# EAGLE design esquematico drone (EAGLE 9.6.2)
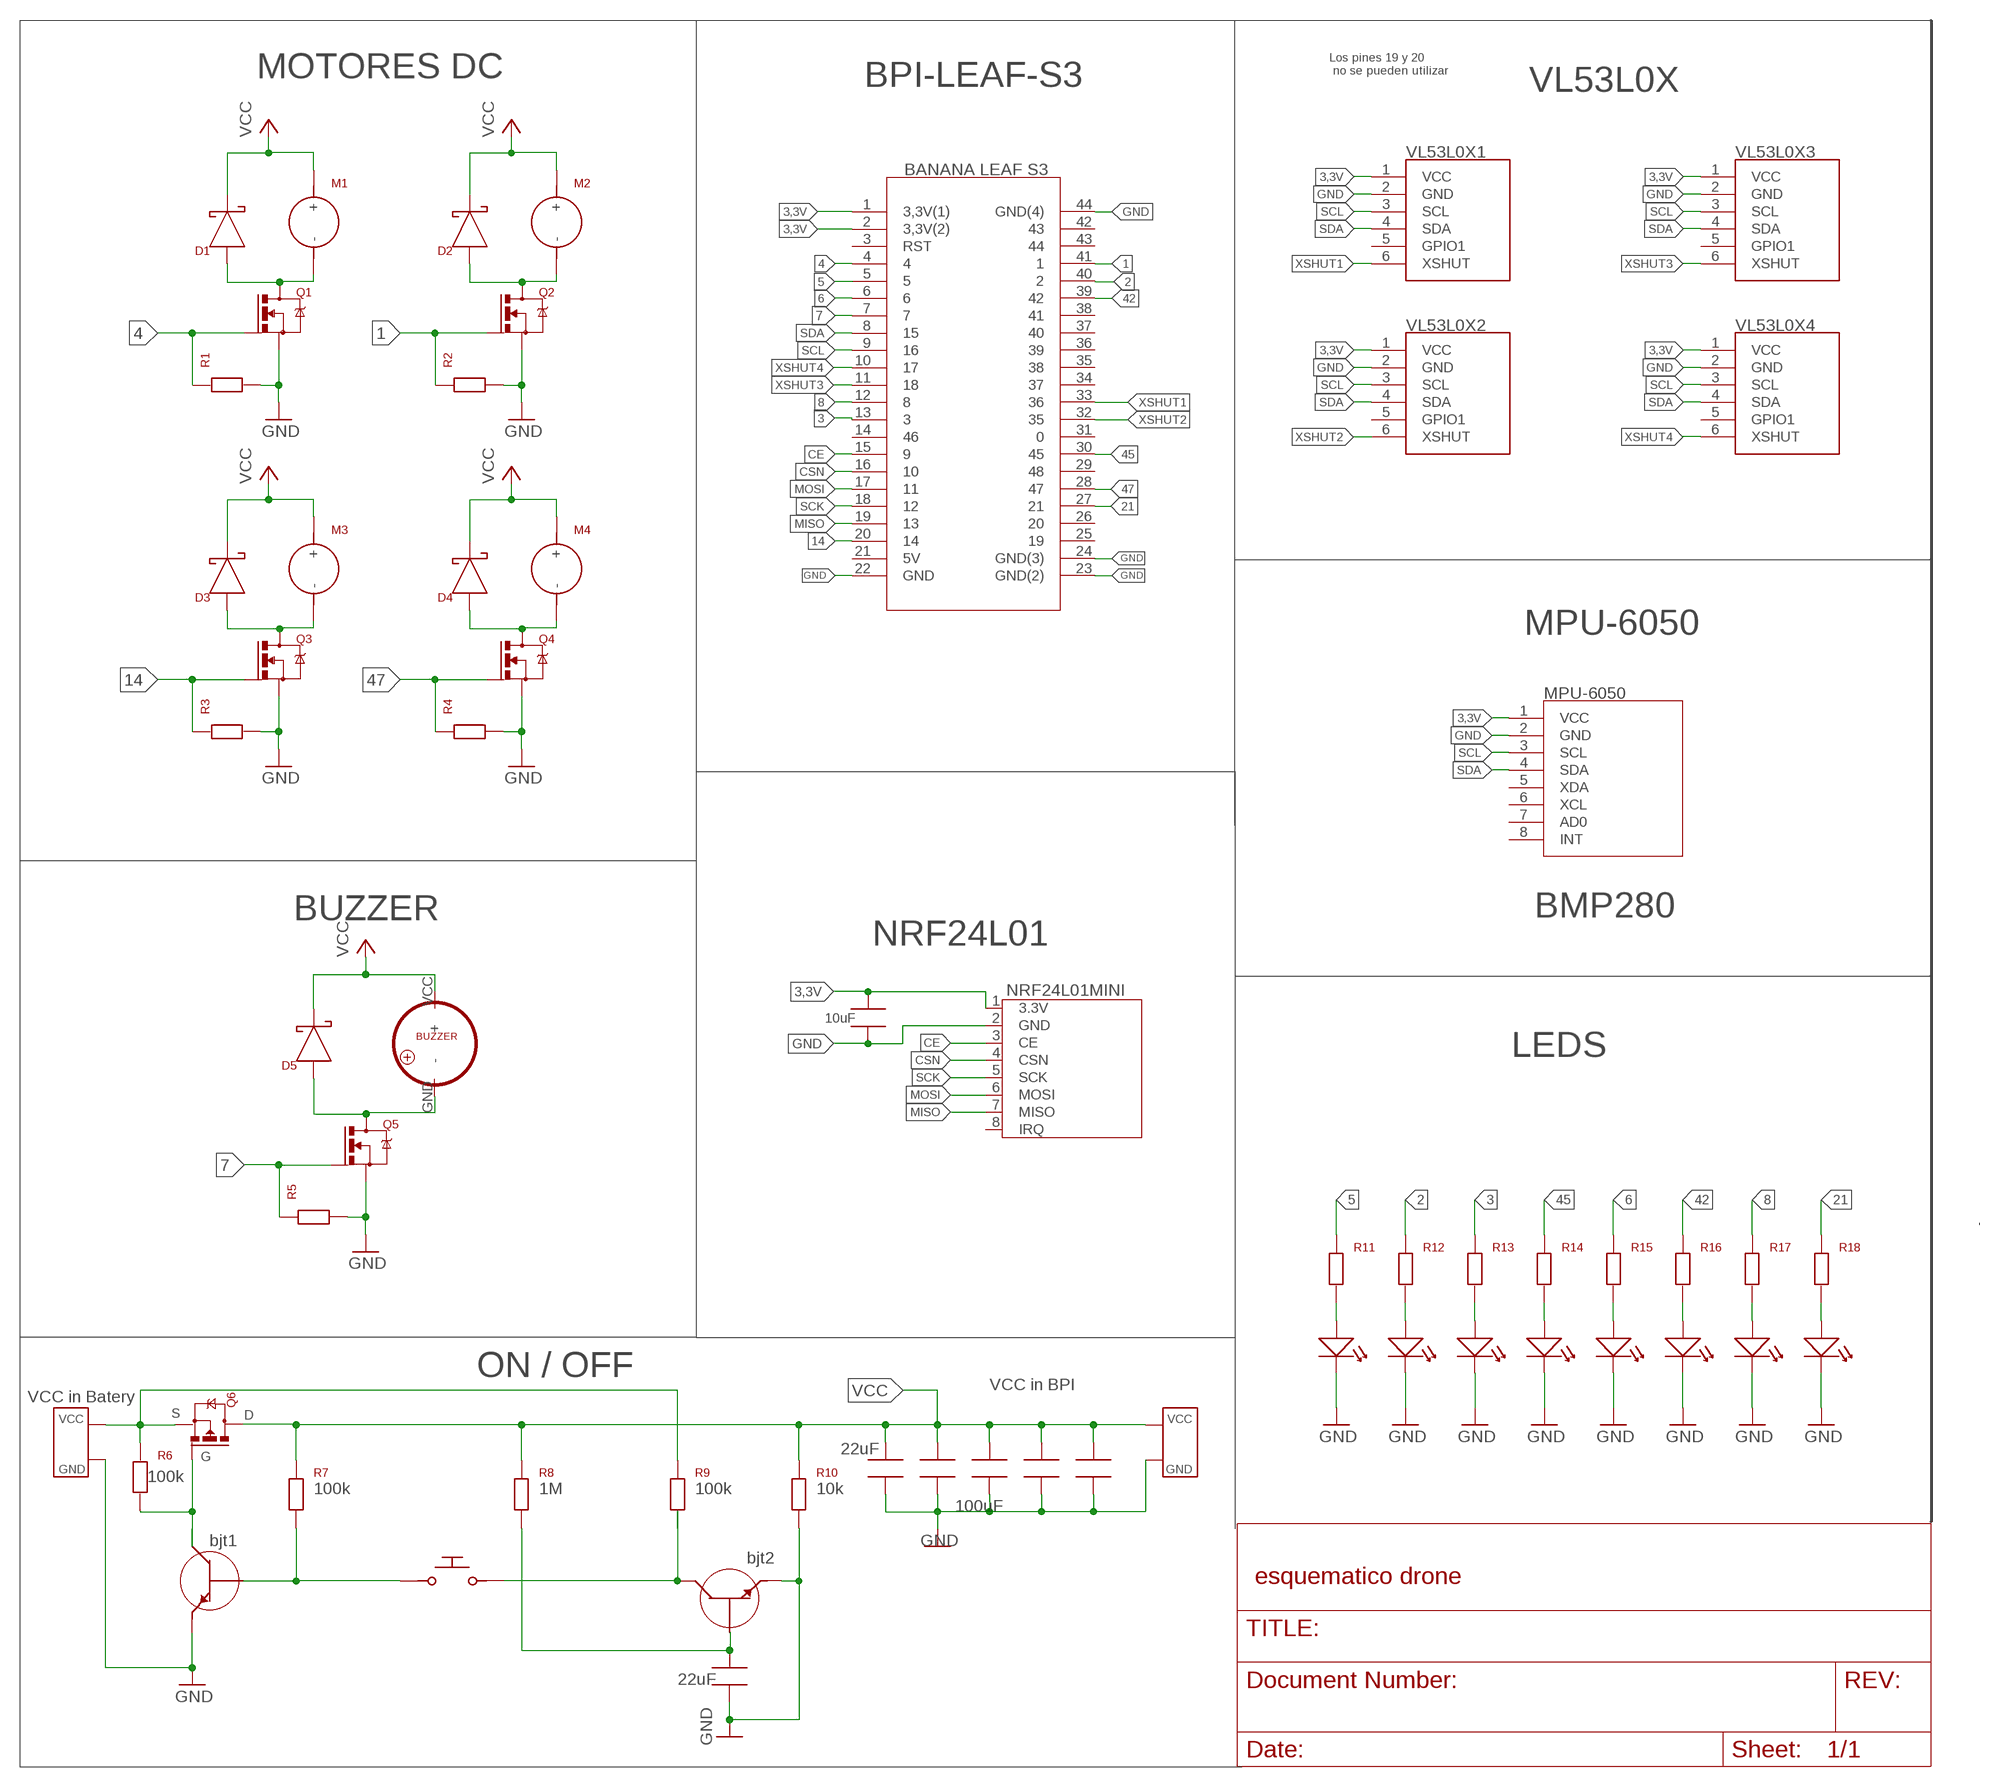
[diagram p0: schematic, sheet 1]

## Parts
BANANALEAFS1  BANANALEAFS3  [BANANALEAF]
BAT1  BATBAT  [BAT]
BAT2  BATBAT  [BAT]
BJT1  MMBT3904  [MMBT3904]
BJT2  MMBT3904  [MMBT3904]
C1  100uF  CAPACITOR-100UFCAPACITOR  [CAPACITOR-100UF]
C2  CAPACITOR-22UF  [CAPACITOR-22UF]
C3  100uF  CAPACITOR-100UFCAPACITOR  [CAPACITOR-100UF]
C4  CAPACITOR-100UFCAPACITOR  [CAPACITOR-100UF]
C5  CAPACITOR-100UFCAPACITOR  [CAPACITOR-100UF]
C6  CAPACITOR-100UFCAPACITOR  [CAPACITOR-100UF]
C7  CAPACITOR-22UF  [CAPACITOR-22UF]
D1  SS12  [SS12]
D2  SS12  [SS12]
D3  SS12  [SS12]
D4  SS12  [SS12]
D5  SS12  [SS12]
LED1  LEDS  [LEDS]
LED2  LEDS  [LEDS]
LED3  LEDS  [LEDS]
LED4  LEDS  [LEDS]
LED5  LEDS  [LEDS]
LED6  LEDS  [LEDS]
LED7  LEDS  [LEDS]
LED8  LEDS  [LEDS]
M1  MOTORM  [MOTOR]
M2  MOTORM  [MOTOR]
M3  MOTORM  [MOTOR]
M4  MOTORM  [MOTOR]
MPU1  MPU6050MPU6050  [MPU6050]
NRF24L1  NRF24L01MINI  [NRF24L01MINI]
P1  PULSADOR  [PULSADOR]
Q1  SI2302  [SI2302]
Q2  SI2302  [SI2302]
Q3  SI2302  [SI2302]
Q4  SI2302  [SI2302]
Q5  SI2302  [SI2302]
Q6  SI2301SI2301  [SI2301]
R1  RESISTOR-0805  [RESISTOR-0805]
R2  RESISTOR-0805  [RESISTOR-0805]
R3  RESISTOR-0805  [RESISTOR-0805]
R4  RESISTOR-0805  [RESISTOR-0805]
R5  RESISTOR-0805  [RESISTOR-0805]
R6  RESISTOR-0805  [RESISTOR-0805]
R7  RESISTOR-0805  [RESISTOR-0805]
R8  RESISTOR-0805  [RESISTOR-0805]
R9  RESISTOR-0805  [RESISTOR-0805]
R10  RESISTOR-0805  [RESISTOR-0805]
R11  RESISTOR-0805  [RESISTOR-0805]
R12  RESISTOR-0805  [RESISTOR-0805]
R13  RESISTOR-0805  [RESISTOR-0805]
R14  RESISTOR-0805  [RESISTOR-0805]
R15  RESISTOR-0805  [RESISTOR-0805]
R16  RESISTOR-0805  [RESISTOR-0805]
R17  RESISTOR-0805  [RESISTOR-0805]
R18  RESISTOR-0805  [RESISTOR-0805]
U$2  BUZZER  [BUZZER]
VL53L0X1  VL53L0X  [VL53L0X]
VL53L0X2  VL53L0X  [VL53L0X]
VL53L0X3  VL53L0X  [VL53L0X]
VL53L0X4  VL53L0X  [VL53L0X]

## Nets
1: BANANALEAFS1.41 Q2.G R2.S1
2: BANANALEAFS1.40 R12.S1
3: BANANALEAFS1.13 R13.S1
3,3V: BANANALEAFS1.1(3,3V(1)) BANANALEAFS1.2(3,3V(2)) C7.S1(C1) MPU1.1(VCC) NRF24L1.1(3.3V) VL53L0X1.1(VCC) VL53L0X2.1(VCC) VL53L0X3.1(VCC) VL53L0X4.1(VCC)
4: BANANALEAFS1.4 Q1.G R1.S1
5: BANANALEAFS1.5 R11.S1
6: BANANALEAFS1.6 R15.S1
7: BANANALEAFS1.7 Q5.G R5.S1
8: BANANALEAFS1.12 R17.S1
14: BANANALEAFS1.20 Q3.G R3.S1
21: BANANALEAFS1.27 R18.S1
42: BANANALEAFS1.39 R16.S1
45: BANANALEAFS1.30 R14.S1
47: BANANALEAFS1.28 Q4.G R4.S1
CE: BANANALEAFS1.15 NRF24L1.3(CE)
CSN: BANANALEAFS1.16 NRF24L1.4(CSN)
GND: BANANALEAFS1.22(GND) BANANALEAFS1.23(GND(2)) BANANALEAFS1.24(GND(3)) BANANALEAFS1.44(GND(4)) BAT1.GND BAT2.GND BJT1.E BJT2.E C1.C2 C2.S2(C2) C3.C2 C4.C2 C5.C2 C6.C2 C7.S2(C2) LED1.C LED2.C LED3.C LED4.C LED5.C LED6.C LED7.C LED8.C MPU1.2(GND) NRF24L1.2(GND) Q1.S Q2.S Q3.S Q4.S Q5.S R1.S2 R2.S2 R3.S2 R4.S2 R5.S2 R10.S2 VL53L0X1.2(GND) VL53L0X2.2(GND) VL53L0X3.2(GND) VL53L0X4.2(GND)
MISO: BANANALEAFS1.19 NRF24L1.7(MISO)
MOSI: BANANALEAFS1.17 NRF24L1.6(MOSI)
N$1: D1.A M1.- Q1.D
N$2: LED1.A R11.S2
N$3: D2.A M2.- Q2.D
N$4: D3.A M3.- Q3.D
N$5: BAT2.VCC Q6.S R6.S1 R9.S1
N$6: BJT1.C Q6.G R6.S2
N$7: D5.A Q5.D U$2.GND(-)
N$8: LED2.A R12.S2
N$9: BJT1.B P1.P1 R7.S2
N$10: BJT2.C P1.P2 R9.S2
N$11: BJT2.B C2.S1(C1) R8.S2
N$12: LED3.A R13.S2
N$13: LED4.A R14.S2
N$14: LED5.A R15.S2
N$15: LED6.A R16.S2
N$16: D4.A M4.- Q4.D
N$17: LED7.A R17.S2
N$18: LED8.A R18.S2
SCK: BANANALEAFS1.18 NRF24L1.5(SCK)
SCL: BANANALEAFS1.9 MPU1.3(SCL) VL53L0X1.3(SCL) VL53L0X2.3(SCL) VL53L0X3.3(SCL) VL53L0X4.3(SCL)
SDA: BANANALEAFS1.8 MPU1.4(SDA) VL53L0X1.4(SDA) VL53L0X2.4(SDA) VL53L0X3.4(SDA) VL53L0X4.4(SDA)
VCC: BAT1.VCC C1.C1 C3.C1 C4.C1 C5.C1 C6.C1 D1.C D2.C D3.C D4.C D5.C M1.+ M2.+ M3.+ M4.+ Q6.D R7.S1 R8.S1 R10.S1 U$2.VCC(+)
XSHUT1: BANANALEAFS1.33 VL53L0X1.6(XSHUT)
XSHUT2: BANANALEAFS1.32 VL53L0X2.6(XSHUT)
XSHUT3: BANANALEAFS1.11 VL53L0X3.6(XSHUT)
XSHUT4: BANANALEAFS1.10 VL53L0X4.6(XSHUT)
Unconnected: BANANALEAFS1.3(RST) BANANALEAFS1.14 BANANALEAFS1.21(5V) BANANALEAFS1.25 BANANALEAFS1.26 BANANALEAFS1.29 BANANALEAFS1.31 BANANALEAFS1.34 BANANALEAFS1.35 BANANALEAFS1.36 BANANALEAFS1.37 BANANALEAFS1.38 BANANALEAFS1.42 BANANALEAFS1.43 MPU1.5(XDA) MPU1.6(XCL) MPU1.7(AD0) MPU1.8(INT) NRF24L1.8(IRQ) VL53L0X1.5(GPIO1) VL53L0X2.5(GPIO1) VL53L0X3.5(GPIO1) VL53L0X4.5(GPIO1)

## Notes on the sheet
- Los pines 19 y 20
   no se pueden utilizar
- BPI-LEAF-S3 | VL53L0X
- MOTORES DC
- MPU-6050
- BUZZER | BMP280
- NRF24L01
- 10uF
- LEDS
- ON / OFF
- VCC in BPI
- VCC in Batery
- S | D
- 22uF
- G
- 100k
- 100k | 1M | 100k | 10k
- 100uF
- bjt1
- bjt2
- 22uF

## Library data of the parts
BANANALEAFS1 = Libreria banana leaf_V2:BANANALEAFS3
BAT1 BAT2 = Libreria banana leaf_V2:BAT
BJT1 BJT2 = Libreria banana leaf_V2:MMBT3904
C1 C3-C6 = Libreria banana leaf_V2:CAPACITOR-100UF
C2 C7 = Libreria banana leaf_V2:CAPACITOR-22UF
D1-D5 = Libreria banana leaf_V2:SS12
LED1-LED8 = Libreria banana leaf_V2:LEDS
M1-M4 = Libreria banana leaf_V2:MOTOR
MPU1 = Libreria banana leaf_V2:MPU6050
NRF24L1 = Libreria banana leaf_V2:NRF24L01MINI
P1 = Libreria banana leaf_V2:PULSADOR
Q1-Q5 = Libreria banana leaf_V2:SI2302
Q6 = Libreria banana leaf_V2:SI2301
R1-R18 = Libreria banana leaf_V2:RESISTOR-0805
U$2 = Libreria banana leaf_V2:BUZZER
VL53L0X1-VL53L0X4 = Libreria banana leaf_V2:VL53L0X

## Board
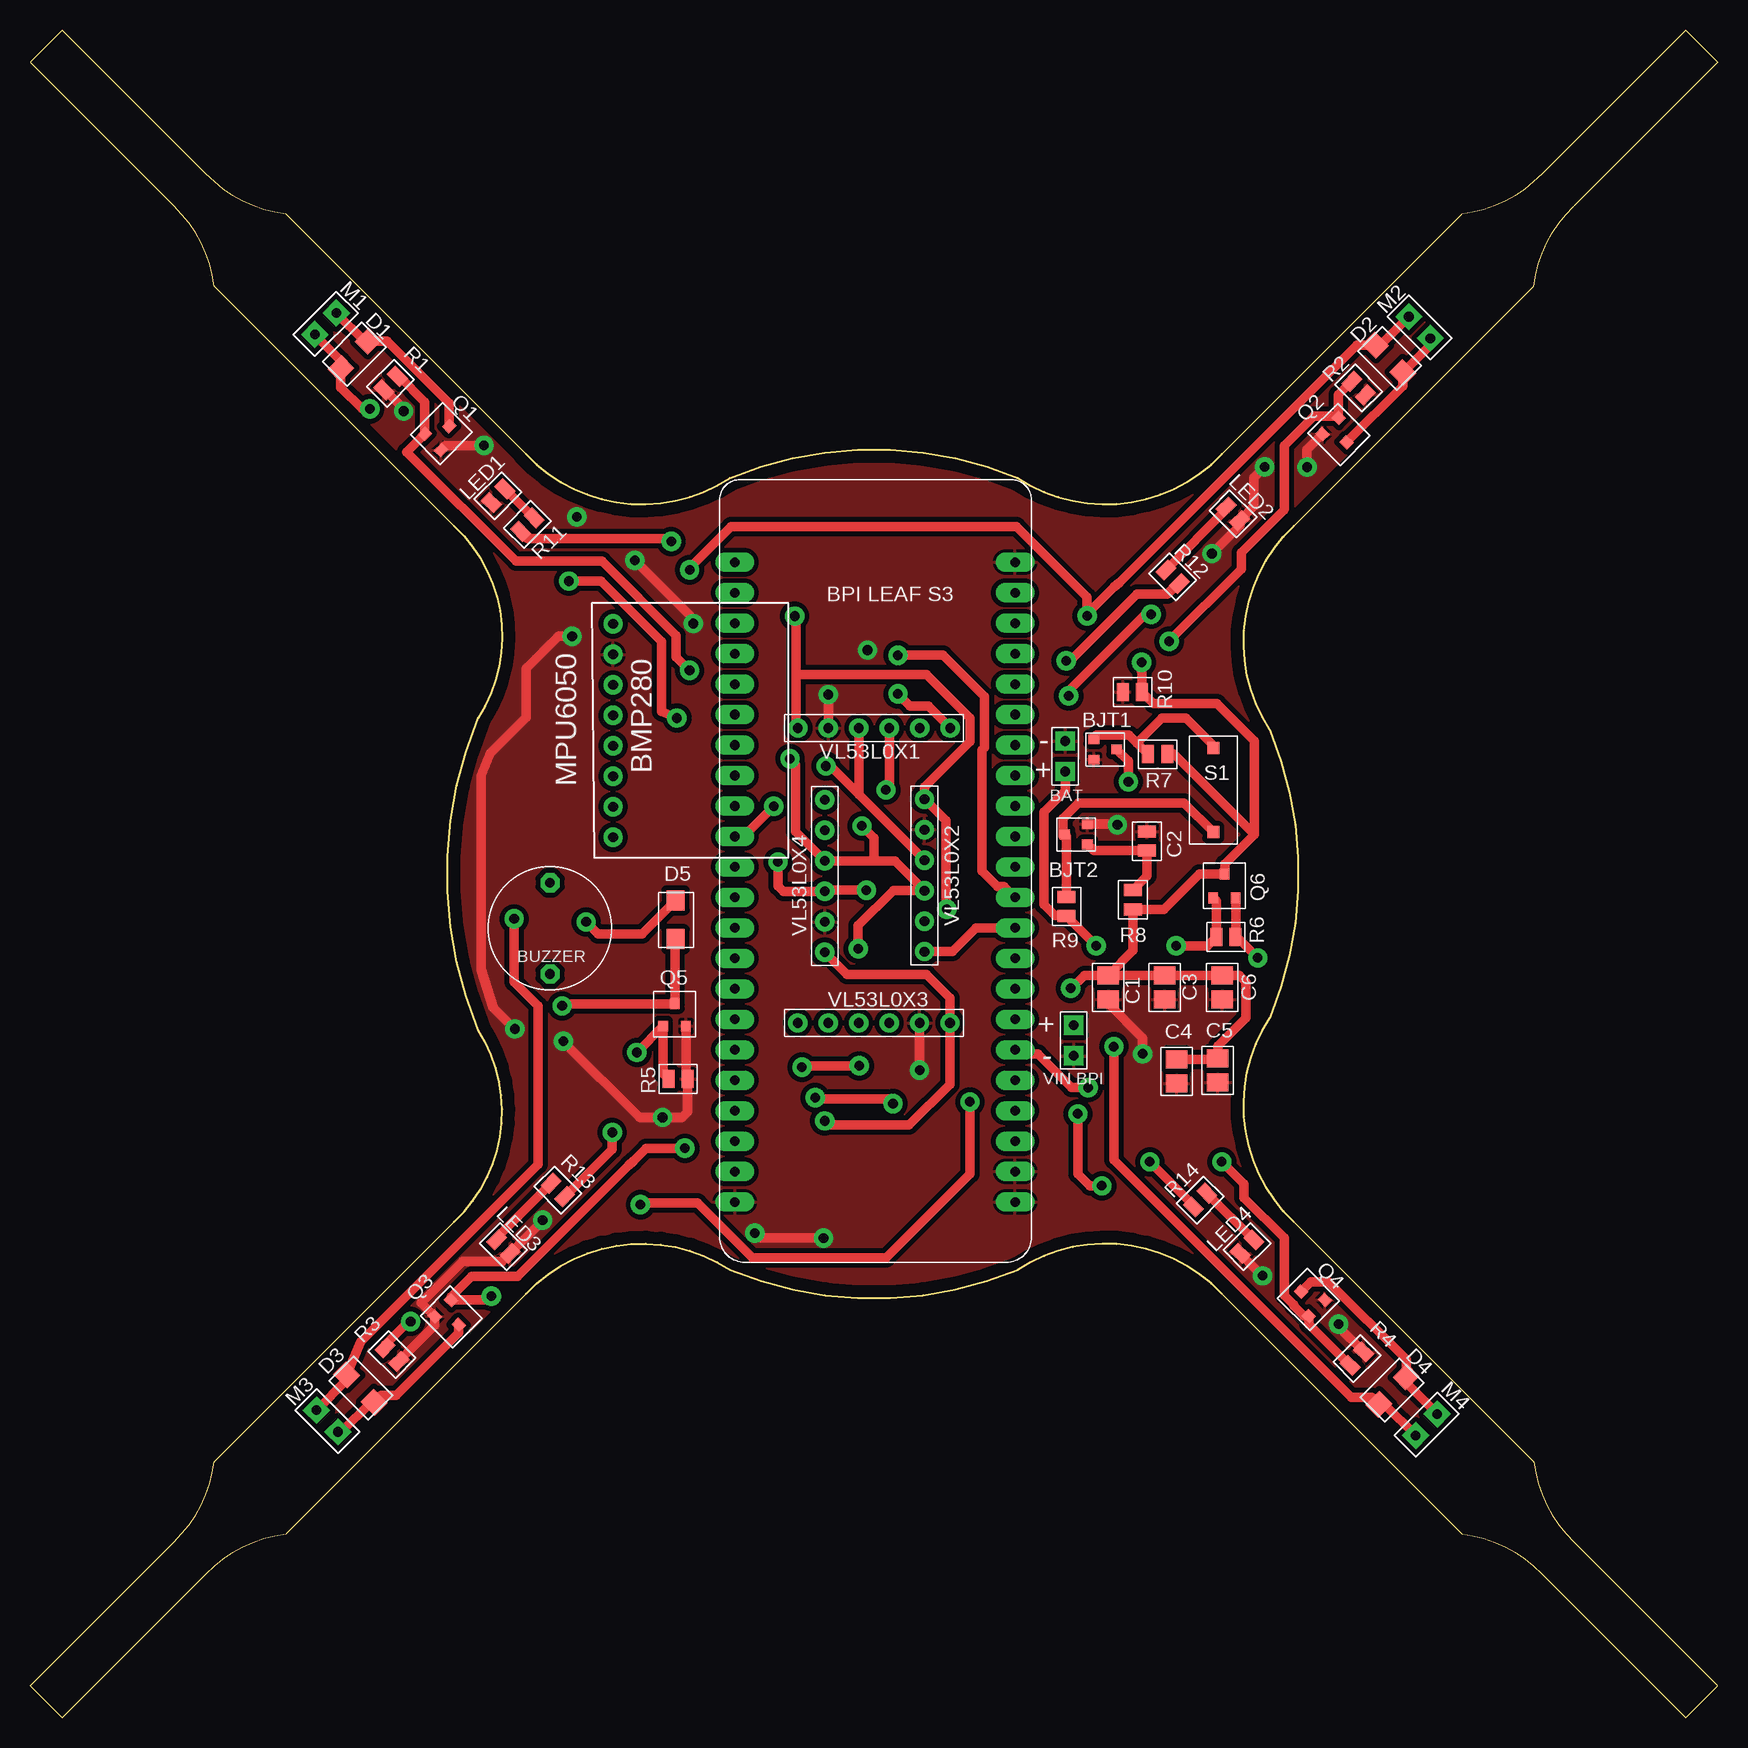
[diagram p1: board, top side]
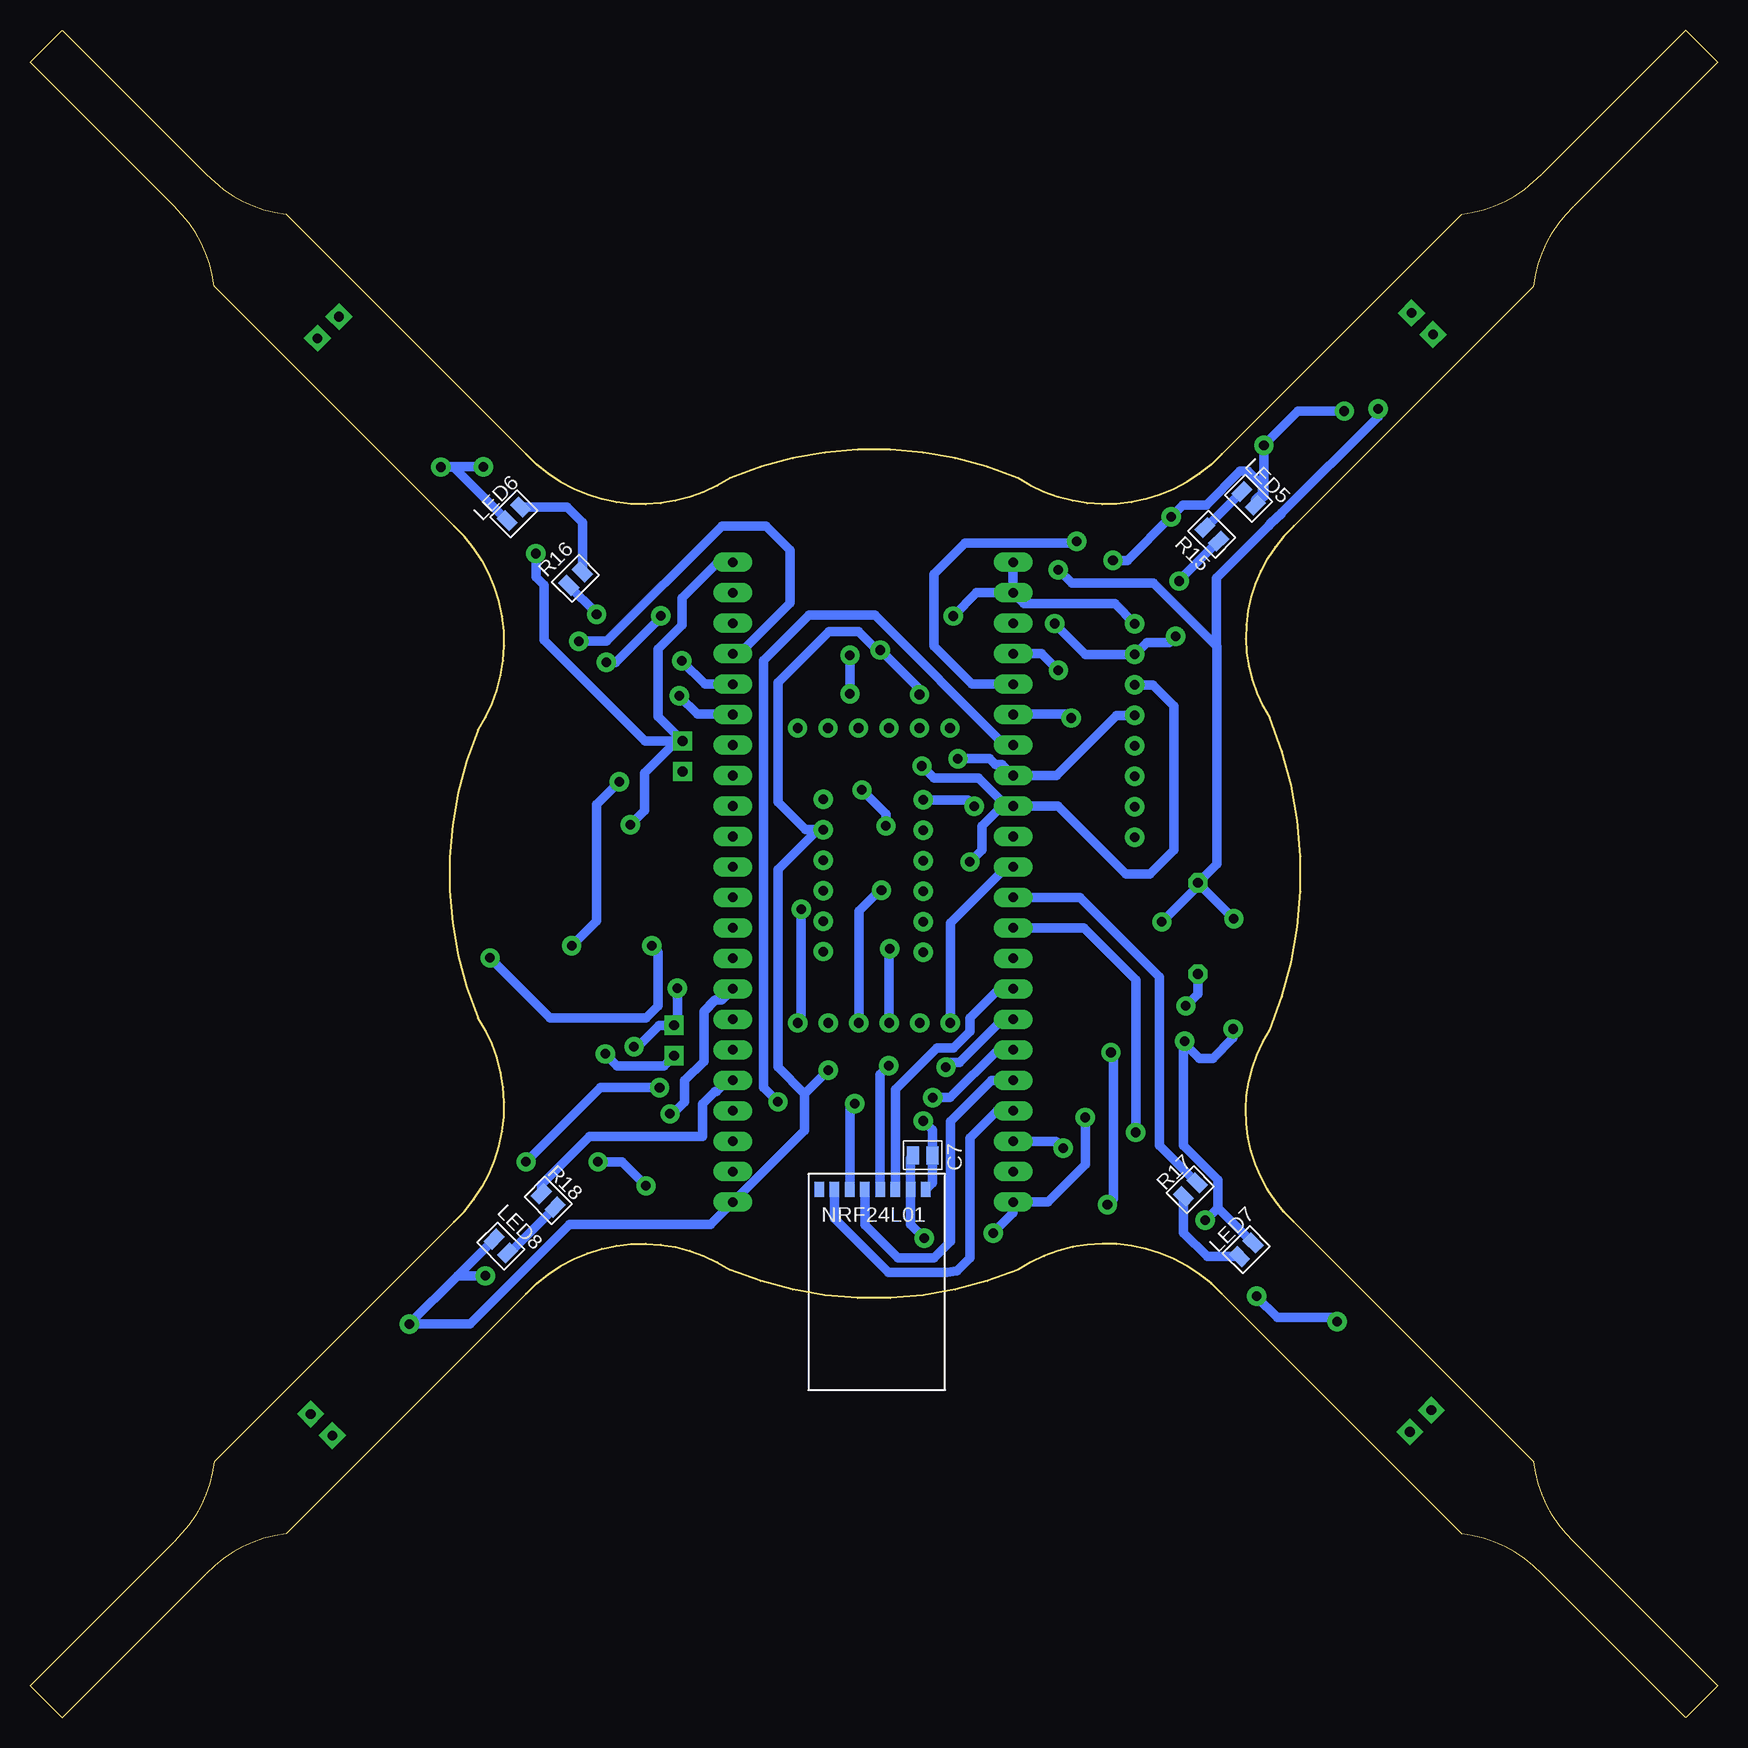
[diagram p2: board, bottom side, seen from below]

Size 140.7 x 140.7 mm. Coordinates in mm from the lower left corner, seen from the top.
Outline: 82.35,103.35 arc80 99.35,105.35 119.35,125.35 arc40 126,128.7 138,140.7 140.7,138 128.7,126 arc40 125.35,119.35 105.35,99.35 arc80 103.35,82.35 arc-45 103.35,58.35 arc80 105.35,41.35 125.35,21.35 arc40 128.7,14.7 140.7,2.7 138,0 126,12 arc40 119.35,15.35 99.35,35.35 arc80 82.35,37.35 arc-45 58.35,37.35 arc80 41.35,35.35 21.35,15.35 arc40 14.7,12 2.7,0 0,2.7 12,14.7 arc40 15.35,21.35 35.35,41.35 arc80 37.35,57.35 arc-45 37.35,83.35 arc80 35.35,99.35 15.35,119.35 arc40 12,126 0,138 2.7,140.7 14.7,128.7 arc40 21.35,125.35 41.35,105.35 arc80 58.35,103.35 arc-45 82.35,103.35
Copper layers (1*16): Top 0.035mm / dielectric 1.5mm / Bottom 0.035mm
Design rules "default *": minimum track width 0.8mm, minimum drill 0.8mm, track to track 16mil, track to pad 16mil, pad to pad 16mil, via to via 16mil, smd to smd 16mil, copper to edge 40mil, drill to drill 6mil, minimum pad ring 16mil, minimum via ring 16mil, stop-mask expansion 4mil, vias tented up to drill 0mil, thermal gap 10mil

### Footprints (pad centres in the part's own frame; a part is rotated, then mirrored left to right if it is on the bottom)
BANANALEAF = drill 0.8 long: 1 1.27,-6.89; 2 1.27,-9.43; 3 1.27,-11.97; 4 1.27,-14.51; 5 1.27,-17.05; 6 1.27,-19.59; 7 1.27,-22.13; 8 1.27,-24.67; 9 1.27,-27.21; 10 1.27,-29.75; 11 1.27,-32.29; 12 1.27,-34.83; 13 1.27,-37.37; 14 1.27,-39.91; 15 1.27,-42.45; 16 1.27,-44.99; 17 1.27,-47.53; 18 1.27,-50.07; 19 1.27,-52.61; 20 1.27,-55.15; 21 1.27,-57.69; 22 1.27,-60.23; 23 24.63,-60.23; 24 24.63,-57.69; 25 24.63,-55.15; 26 24.63,-52.61; 27 24.63,-50.07; 28 24.63,-47.53; 29 24.63,-44.99; 30 24.63,-42.45; 31 24.63,-39.91; 32 24.63,-37.37; 33 24.63,-34.83; 34 24.63,-32.29; 35 24.63,-29.75; 36 24.63,-27.21; 37 24.63,-24.67; 38 24.63,-22.13; 39 24.63,-19.59; 40 24.63,-17.05; 41 24.63,-14.51; 42 24.63,-11.97; 43 24.63,-9.43; 44 24.63,-6.89
BAT = drill 0.8 square: GND 0,-1.27; VCC 0,1.27
MMBT3904 = smd 0.9 x 0.8: B 0,0.2; C 1.9,-0.65; E 0,-1.5
CAPACITOR-100UF = smd 1.8 x 1.5: C1 0,1.27; C2 0,-0.73
CAPACITOR-22UF = smd 1.5 x 1: S1 0,0.8; S2 0,-0.8
SS12 = smd 1.52 x 1.65: A 0,0; C 0,-3.23
LEDS = smd 1.5 x 1: A 0,0.8; C 0,-0.8
MOTOR = drill 0.8 square: + 0,0; - 0,-2.54
MPU6050 = drill 0.8: 1 1.78,-1.72; 2 1.78,-4.26; 3 1.78,-6.8; 4 1.78,-9.34; 5 1.78,-11.88; 6 1.78,-14.42; 7 1.78,-16.96; 8 1.78,-19.5
NRF24L01MINI = smd 1.27 x 0.8: 1 0,8.89; 2 0,7.62; 3 0,6.35; 4 0,5.08; 5 0,3.81; 6 0,2.54; 7 0,1.27; 8 0,0
PULSADOR = smd 1 x 1: P1 0,4; P2 0,-3
SI2302 = smd 0.9 x 0.8: D 0.63,0.29; G -1.27,1.27; S -1.27,-0.63
SI2301 = smd 0.9 x 0.8: D 2,-0.98; G 0,0; S 0,-1.9
RESISTOR-0805 = smd 1.5 x 1: S1 0,0.8; S2 0,-0.8
BUZZER = drill 0.8 octagon: GND 0,-7.6; VCC 0,0
VL53L0X = drill 0.8: 1 2.54,-1.27; 2 2.54,-3.81; 3 2.54,-6.35; 4 2.54,-8.89; 5 2.54,-11.43; 6 2.54,-13.97

### Placement (x,y rotation side)
BANANALEAFS1  57.48,103.22 0 top
BAT1  87.01,56.46 0 top
BAT2  86.3,80.16 180 top
BJT1  88.68,81.38 0 top
BJT2  88.16,73 180 top
C1  89.88,60.63 0 top
C2  93.11,73.09 180 top
C3  94.59,60.61 0 top
C4  95.59,53.6 0 top
C5  99.01,53.69 0 top
C6  99.38,60.62 0 top
C7  66.28,46.91 270 bottom
D1  28.2,114.77 315 top
D2  114.44,112.15 225 top
D3  28.69,26.32 225 top
D4  114.71,28.42 315 top
D5  53.81,64.92 180 top
LED1  39.02,101.88 315 top
LED2  100.27,100.36 45 top
LED3  39.45,39.29 45 top
LED4  101.44,39.28 315 top
LED5  39.11,101.66 45 bottom
LED6  100.37,100.36 315 bottom
LED7  39.31,39.02 135 bottom
LED8  101.44,39.34 225 bottom
M1  23.74,115.31 135 top
M2  114.94,116.8 45 top
M3  23.88,25.65 45 top
M4  115.51,23.54 135 top
MPU1  46.82,92.91 0 top
NRF24L1  74.91,44.06 270 bottom
P1  98.64,76.83 0 top
Q1  34.71,107.02 45 top
Q2  109.08,106.57 315 top
Q3  35.09,33.01 315 top
Q4  106.6,35.29 135 top
Q5  54.04,58.94 90 top
Q6  98.61,68.36 90 top
R1  30.06,111.26 315 top
R2  110.76,110.85 45 top
R3  30.18,30.29 45 top
R4  110.61,29.95 135 top
R5  54.02,53.26 90 top
R6  99.68,65.09 270 top
R7  93.99,80.33 270 top
R8  91.94,68.2 180 top
R9  86.41,67.64 180 top
R10  91.9,85.51 270 top
R11  41.46,99.47 135 top
R12  95.25,95.11 225 top
R13  44.01,44.01 225 top
R14  97.55,43.17 135 top
R15  42.19,98.66 225 bottom
R16  95.22,94.97 135 bottom
R17  43.98,44.04 315 bottom
R18  97.5,43.14 45 bottom
U$2  43.35,69.61 0 top
VL53L0X1  62.75,79.97 90 top
VL53L0X2  72.03,77.85 0 top
VL53L0X3  77.96,60.47 270 top
VL53L0X4  68.79,62.55 180 top

### Tracks (layer width: path | path; a pad name or v marks a point on that pad's centre or on a via)
1  (via drill 0.8)
  Top 0.8: R2.S1 109.08,110.31 Q2.G 108.92,108.53 107.04,108.53 104.58,106.07 104.58,100.74 104.51,100.67 100.98,97.14 100.98,95.76 v94.96,89.74
  Bottom 0.8: v94.96,89.74 92.63,89.74 83.02,99.35 79.35,99.35 77.35,97.35 77.35,92.93 81.57,88.71 BANANALEAFS1.41
2  (via drill 0.8)
  Top 0.8: R12.S1 95.67,94.55 94.81,93.7 92.28,93.7 86.69,88.11 v86.37,88.11
  Bottom 0.8: v86.37,88.11 84.43,86.17 BANANALEAFS1.40
3  (via drill 0.8)
  Top 0.8: v48.53,48.8 48.53,47.4 R13.S1
  Bottom 0.8: v48.53,48.8 48.51,48.83 48.51,61.5 52.85,65.85 BANANALEAFS1.13
3,3V  (via drill 0.8)
  Top 0.8: v66.24,49.76 66.59,49.41 73.28,49.41 76.69,52.82 VL53L0X3.1 | VL53L0X4.1 68.09,61.98 74.72,61.98 76.69,60.01 VL53L0X3.1 | VL53L0X3.1 76.46,58.16 | VL53L0X1.1 63.85,82.68 63.85,86.97 | 63.85,86.97 63.85,91.85 v63.74,91.85 | 63.85,86.97 74.73,86.97 78.35,83.35 78.35,81.37 74.56,77.58 VL53L0X2.1 76.35,74.8 76.35,67.35 v76.42,67.42
  Bottom 0.8: BANANALEAFS1.2 57.83,92.87 50.28,92.87 MPU1.1 | v63.74,91.85 61.79,93.79 BANANALEAFS1.2 | BANANALEAFS1.1 BANANALEAFS1.2 | NRF24L1.1 65.48,44.61 C7.S1 65.48,49 v66.24,49.76 | v76.42,67.42 76.42,58.2 VL53L0X3.1
4  (via drill 0.8)
  Top 0.8: R1.S1 30.77,111.83 32.91,109.68 Q1.G 31.41,105.52 40.51,96.42 47.67,96.42 53.86,90.24 53.86,88.44 v54.98,87.32
  Bottom 0.8: v54.98,87.32 56.37,88.71 BANANALEAFS1.4
5  (via drill 0.8)
  Top 0.8: R11.S1 41.48,98.32 53.19,98.32 v53.45,98.06
  Bottom 0.8: v53.45,98.06 53.56,97.95 62.75,97.95 65.35,95.35 65.35,89.35 62.17,86.17 BANANALEAFS1.5
6  (via drill 0.8)
  Top 0.8: v44.92,94.76 47.62,94.76 52.65,89.74 52.65,83.88 v53.92,83.35
  Bottom 0.8: R15.S1 44.92,94.79 v44.92,94.76 | v53.92,83.35 54.27,83.69 58.69,83.69 BANANALEAFS1.6
7  (via drill 0.8)
  Top 0.8: R5.S1 52.77,53.71 Q5.G 50.59,55.49 v50.59,55.47 | v78.35,51.35 78.35,45.35 71.35,38.35 60.21,38.35 55.64,42.92 51.02,42.92 v50.89,42.78
  Bottom 0.8: BANANALEAFS1.7 59.45,81.09 70.28,91.92 75.78,91.92 79.56,88.14 79.56,52.56 v78.35,51.35 | v50.59,55.47 50.41,55.28 50.41,43.26 v50.89,42.78
8
  Bottom 0.8: R17.S1 46.54,47.73 46.54,61.76 53.17,68.39 BANANALEAFS1.12
14  (via drill 0.8)
  Top 0.8: v31.73,33.04 31.57,33.04 29.61,31.08 R3.S1 | v38.45,35.16 38.14,34.84 35.13,34.84 Q3.G 35.09,35.08 36.83,36.81 40.65,36.81 49.9,46.07 50.33,46.44 51.37,47.48 v54.59,47.48
  Bottom 0.8: v31.73,33.04 31.57,33.2 31.75,33.38 36.73,33.38 38.45,35.1 v38.45,35.16 | v54.59,47.48 55.19,48.07 BANANALEAFS1.20
21
  Bottom 0.8: R18.S1 98.07,44.46 94.04,48.49 84.66,48.49 84.66,51.16 83.59,52.23 83.47,52.23 82.55,53.15 BANANALEAFS1.27
42  (via drill 0.8)
  Top 0.8: v93.47,92 93,92 86.58,85.58 v86.58,85.19
  Bottom 0.8: R16.S1 93.47,92.09 v93.47,92 | BANANALEAFS1.39 82.16,83.68 85.07,83.68 v86.58,85.19
45  (via drill 0.8)
  Top 0.8: v87.35,50.35 87.35,45.35 88.35,44.35 v89.35,44.35 | v93.35,46.35 96.98,42.72 R14.S1
  Bottom 0.8: BANANALEAFS1.30 83.04,59.85 83.59,59.85 84.53,58.9 84.53,54.72 86.12,53.13 86.12,51.35 87.12,50.35 v87.35,50.35 | v89.35,44.35 91.35,46.35 v93.35,46.35
47  (via drill 0.8)
  Top 0.8: R4.S1 106.6,32.82 Q4.G 106.21,33.49 105.35,34.35 105.35,34.42 104.54,35.23 104.54,39.99 101.19,43.34 101.19,44.51 v99.35,46.35 | BANANALEAFS1.28 82.46,55.35 84.01,55.35 86.82,52.54 v88.22,52.54
  Bottom 0.8: v88.22,52.54 93.16,52.54 v99.35,46.35
CE
  Bottom 0.8: NRF24L1.3 68.55,44.08 68.55,52.4 65.1,55.85 63.74,55.85 62.35,57.24 62.35,58.35 59.93,60.77 BANANALEAFS1.15
CSN  (via drill 0.8)
  Top 0.8: v69.13,54.36 64.36,54.36 64.35,54.35 v64.35,54.24
  Bottom 0.8: NRF24L1.4 69.83,53.65 v69.13,54.36 | v64.35,54.24 63.94,54.65 63.24,54.65 59.65,58.23 BANANALEAFS1.16
GND  (via drill 0.8)
  Top 0.8: R3.S2 33.75,32.73 Q3.S 32.61,34.6 36.05,38.05 39.34,38.05 LED3.C 42.73,41.44 v42.73,41.49 | Q5.S 54.67,53.41 R5.S2 54.82,50.53 54.34,50.05 v52.73,50.05 50.8,50.05 v44.45,56.41 | LED4.C 100.88,38.68 102.71,36.85 v102.75,36.85 | C1.C2 89.88,59.53 92.75,56.67 v92.75,55.35 | v98.52,97.05 100.84,99.37 LED2.C 102.04,101 102.04,103.41 v102.92,104.29 | v106.45,104.26 106.45,105.73 Q2.S | v55.29,91.22 55.29,91.61 v50.43,96.48 | v31.14,108.93 31.14,109.16 29.6,110.69 R1.S2 | R4.S2 109.08,32.61 v109.08,32.83 | Q1.S 34.62,106.04 37.82,106.04 v37.85,106.07 | BJT2.E 90.59,74.5 v90.64,74.45 | v40.41,57.43 38.62,59.22 37.59,62.38 37.59,78.55 38.36,80.4 41.35,83.4 41.35,87.46 44.06,90.17 v45.19,90.17 | v60.42,40.42 60.85,39.99 v66.14,39.99 | v74.15,54 VL53L0X3.2 | v66.56,85.3 VL53L0X1.2
  Bottom 0.8: 76.12,52.03 v74.15,54 | 76.12,52.03 76.12,48.99 BANANALEAFS1.23 83.95,41.15 95.71,41.15 104.03,32.83 v109.08,32.83 105.06,36.85 | 44.55,56.3 44.55,47.73 41.68,44.87 41.68,42.52 LED7.C 41.69,42.53 v42.73,41.49 | 44.55,56.3 v44.45,56.41 | v52.73,50.05 52.73,46.12 55.86,42.99 BANANALEAFS1.22 58.75,42.09 v60.42,40.42 | v40.41,57.43 40.41,56.67 42.1,54.99 43.23,54.99 44.55,56.3 | v90.64,74.45 89.47,75.63 89.47,78.78 86.82,81.43 BAT2.GND | 76.12,52.03 78.35,54.26 78.35,70.71 75.01,74.04 VL53L0X2.2 76.04,74.04 78.35,76.35 78.35,86.29 74.1,90.54 71.62,90.54 70.1,89.01 v69.81,89.01 66.56,85.76 v66.56,85.3 | v98.52,97.05 98.5,97.03 98.5,95.08 97.85,94.43 97.85,89.85 89.43,81.43 BAT2.GND | LED8.C 105.06,36.85 | v50.43,96.48 49.23,96.48 v45.59,100.13 44.61,101.1 42.66,101.1 39.84,103.92 39.17,103.92 37.99,102.74 37.99,102.07 38.55,101.51 LED5.C 37.85,101.79 v37.85,106.07 35,108.93 v31.14,108.93 | v55.29,91.22 52.72,88.65 MPU1.2 47.6,89.65 45.71,89.65 v45.19,90.17 | v92.75,55.35 91.75,54.35 87.85,54.35 BAT1.GND | v102.75,36.85 105.06,36.85 | LED6.C 105.4,104.26 v106.45,104.26 106.43,104.29 v102.92,104.29 | BAT2.GND 88.35,83.47 88.35,89.11 86.35,91.11 86.35,93.35 83.37,96.33 BANANALEAFS1.44 | C7.S2 67.29,46.69 NRF24L1.2 67.29,41.14 v66.14,39.99
  pour Top: 36.15,98.55 15.35,119.35 15.35,121.35 19.35,125.35 21.35,125.35 42.15,104.55 arc82 58.35,103.35 arc-73 82.25,103.45 arc81 98.75,104.75 119.35,125.35 121.35,125.35 125.35,121.35 125.35,119.35 104.95,98.95 arc78 103.25,82.45 arc-66 103.35,58.35 arc78 105.25,41.45 125.35,21.35 125.35,19.35 121.35,15.35 119.35,15.35 98.65,36.05 arc81 82.35,37.35 arc-72 58.35,37.35 arc81 42.05,36.05 21.35,15.35 19.35,15.35 15.35,19.35 15.35,21.35 36.25,42.25 arc82 37.35,57.35 arc-74 37.45,83.55 arc84
MISO
  Bottom 0.8: NRF24L1.7 73.64,41.64 69.14,37.14 64.24,37.14 63.43,37.27 62.35,38.35 62.35,48.35 60.09,50.61 BANANALEAFS1.19
MOSI  (via drill 0.8)
  Top 0.8: v71.94,51.2 71.55,51.59 65.56,51.59 v65.45,51.7
  Bottom 0.8: NRF24L1.6 72.35,44.09 72.35,51.2 v71.94,51.2 | v65.45,51.7 64,51.7 60.01,55.69 BANANALEAFS1.17
N$1
  Top 0.8: Q1.D 34.95,109.58 29.76,114.77 D1.A 27.88,114.77 M1.-
N$2
  Top 0.8: LED1.A 41.99,100.04 R11.S2
N$3
  Top 0.8: Q2.D 109.75,106.33 114.44,111.02 D2.A 116.73,114.44 M2.-
N$4
  Top 0.8: M3.- 25.96,23.85 28.43,26.32 D3.A 29.26,26.88 30.52,26.88 35.74,32.1 Q3.D
N$5  (via drill 0.8)
  Top 0.8: v88.86,64.38 v88.86,64.39 R9.S1 86.35,66.9 85.42,66.9 84.53,67.78 84.53,75.53 86.3,77.3 BAT2.VCC | v102.35,63.35 100.61,65.09 | 100.61,65.09 R6.S1 | 100.61,65.09 100.51,65.19 Q6.S
  Bottom 0.8: v88.86,64.38 88.35,63.86 88.35,59.35 89.35,58.35 97.35,58.35 v102.35,63.35
N$6  (via drill 0.8)
  Top 0.8: Q6.G 98.88,68.08 R6.S2 98.15,64.36 v95.55,64.36 | BJT1.C 91.56,79.74 v91.56,78.04
  Bottom 0.8: v91.56,78.04 93.48,76.13 93.48,66.43 v95.55,64.36
N$7  (via drill 0.8)
  Top 0.8: D5.A 53.75,64.86 Q5.D 53.68,59.5 44.5,59.5 v44.35,59.35
  Bottom 0.8: v44.35,59.35 43.35,60.35 U$2.GND
N$8
  Top 0.8: LED2.A 99.71,100.7 R12.S2
N$9
  Top 0.8: BJT1.B 88.68,81.73 88.88,81.94 91.59,81.94 92.26,81.26 | 92.26,81.26 R7.S2 | P1.P1 98.64,81.06 96.35,83.35 94.35,83.35 92.26,81.26
N$10
  Top 0.8: R9.S2 86.41,73.5 BJT2.C 86.1,73.5 86.1,74.95 87.41,76.26 96.2,76.26 P1.P2
N$11
  Top 0.8: R8.S2 93.11,70.17 C2.S1 88.67,72.29 BJT2.B
N$12
  Top 0.8: LED3.A 38.89,40.02 R13.S2
N$13
  Top 0.8: LED4.A 98.12,43.73 R14.S2
N$14
  Bottom 0.8: LED5.A 42.68,99.22 R15.S2
N$15
  Bottom 0.8: R16.S2 94.66,99.66 95.93,100.93 LED6.A
N$16
  Top 0.8: Q4.D 106.77,36.35 108.24,36.35 114.71,29.88 D4.A 114.71,27.93 M4.-
N$17
  Bottom 0.8: R17.S2 44.54,40.42 42.57,38.45 LED7.A
N$18
  Bottom 0.8: LED8.A 100.74,38.77 R18.S2
SCK
  Bottom 0.8: BANANALEAFS1.18 60.55,53.15 63.97,49.73 63.97,39.73 65.35,38.35 68.35,38.35 71.1,41.1 NRF24L1.5
SCL  (via drill 0.8)
  Top 0.8: VL53L0X2.3 69.1,76.97 | 69.1,76.97 VL53L0X1.3 | v69.72,69 66.35,69 VL53L0X4.3 62.8,68.9 62.35,69.35 v62.35,71.35 | v66.35,79.35 66.72,79.35 69.1,76.97
  Bottom 0.8: BANANALEAFS1.9 59.3,76.01 61.64,78.35 65.35,78.35 v66.35,79.35 | BANANALEAFS1.9 55.01,76.01 49.35,70.35 47.35,70.35 45.35,72.35 45.35,84.35 47.11,86.11 MPU1.3 | v69.72,69 69.85,69 71.61,67.25 VL53L0X3.3 | v62.35,71.35 61.35,72.35 61.35,74.35 59.69,76.01 BANANALEAFS1.9
SDA  (via drill 0.8)
  Top 0.8: 70.35,71.44 72.09,71.44 VL53L0X2.4 71.96,68.96 69.03,66.03 v69.03,64.11 | 70.35,71.44 VL53L0X4.4 63.83,73.87 63.83,79.49 v63.35,79.96 | VL53L0X1.4 71.64,77.64 v71.35,77.35 | v69.35,74.35 70.35,73.35 70.35,71.44
  Bottom 0.8: v63.35,79.96 60.71,79.96 60.23,79.48 59.68,79.48 BANANALEAFS1.8 55.15,78.55 50.13,83.57 MPU1.4 | v69.03,64.11 69.1,64.04 69.1,57.96 VL53L0X3.4 | v71.35,77.35 69.35,75.35 v69.35,74.35
VCC  (via drill 0.8)
  Top 0.8: M1.+ 25.92,113.14 D1.C 25.92,110.89 27.69,109.12 v28.32,109.12 | M4.+ 112.91,26.14 D4.C 111.86,26.7 110.15,26.7 90.35,46.5 v90.35,55.96 | v54.98,95.7 54.98,95.86 58.45,99.32 82.22,99.32 88.11,93.42 88.11,92 | M2.+ 112.57,114.44 D2.C 110.6,114.44 90.8,94.63 90.37,94.26 88.11,92 | 102.05,73.65 99.59,71.19 Q6.D 97.49,70.36 94.54,67.4 R8.S1 91.94,63.96 C1.C1 | R7.S1 95.37,80.33 102.05,73.65 | 102.05,73.65 102.05,81.43 98.93,84.56 93.66,84.56 R10.S1 92.7,87.17 92.66,87.22 v92.66,87.98 | D5.C 51.01,65.35 47.35,65.35 v46.35,66.35 | M3.+ 26.41,28.17 D3.C 27.54,31.34 42.35,46.15 42.35,59.35 40.35,61.35 v40.35,66.61 | C1.C1 94.58,61.9 C3.C1 C6.C1 100.81,61.89 101.35,61.35 101.35,58.35 99.01,56.01 C5.C1 98.92,54.87 C4.C1 | C1.C1 87.9,61.9 86.83,60.83 v86.74,60.83 | 88.11,92 v88.11,91.86
  Bottom 0.8: U$2.VCC 41.78,71.18 41.78,89.31 41.8,89.33 | v54.98,95.7 53.87,94.58 47.05,94.58 41.8,89.33 | v92.66,87.98 91.89,87.98 88.11,91.77 v88.11,91.86 | v28.32,109.12 28.32,108.49 36.39,100.42 36.4,100.41 | 41.8,89.33 41.8,95.02 37.46,99.35 37.27,99.61 36.4,100.41 | 36.4,100.41 | v40.35,66.61 U$2.VCC | v46.35,66.35 43.35,69.35 U$2.VCC | v90.35,55.96 90.03,55.96 88.27,57.73 BAT1.VCC 86.74,58 v86.74,60.83
XSHUT1  (via drill 0.8)
  Top 0.8: VL53L0X1.6 74.88,84.35 73.35,84.35 v72.35,85.35 | v72.35,88.58 76.12,88.58 79.56,85.14 79.56,80.87 79.35,80.66 79.35,70.61 80.64,69.32 81.19,69.32 BANANALEAFS1.33
  Bottom 0.8: v72.35,85.35 v72.35,88.58
XSHUT2
  Top 0.8: VL53L0X2.6 76.88,63.88 78.85,65.85 BANANALEAFS1.32
XSHUT3
  Bottom 0.8: BANANALEAFS1.11 59.3,70.93 63.99,66.24 VL53L0X3.6
XSHUT4  (via drill 0.8)
  Top 0.8: BANANALEAFS1.10 59.47,73.47 v61.99,75.99
  Bottom 0.8: v61.99,75.99 62.53,76.52 VL53L0X4.6

### Text on the board
tNames: - | BMP280 | + | S1 | BAT | + | - | VIN BPI